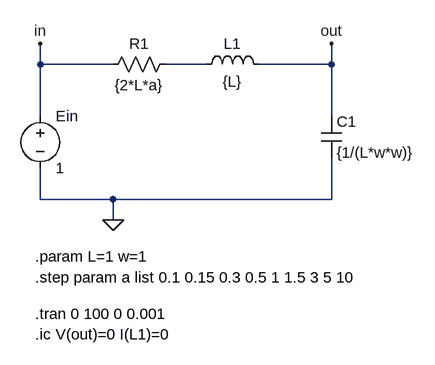
[diagram p0: schematic step-analysis.asc]
step-analysis.asc, the LTspice schematic file:
Version 4
SHEET 1 880 680
WIRE 0 48 0 16
WIRE 112 48 0 48
WIRE 256 48 192 48
WIRE 448 48 448 16
WIRE 448 48 336 48
WIRE 0 128 0 48
WIRE 448 128 448 48
WIRE 0 256 0 208
WIRE 112 256 0 256
WIRE 448 256 448 192
WIRE 448 256 112 256
WIRE 112 288 112 256
FLAG 112 288 0
FLAG 0 16 in
FLAG 448 16 out
SYMBOL voltage 0 112 R0
SYMATTR InstName Ein
SYMATTR Value 1
SYMBOL res 208 32 R90
WINDOW 0 0 56 VBottom 2
WINDOW 3 32 56 VTop 2
SYMATTR InstName R1
SYMATTR Value {2*L*a}
SYMBOL ind 352 64 M270
WINDOW 0 32 56 VTop 2
WINDOW 3 5 56 VBottom 2
SYMATTR InstName L1
SYMATTR Value {L}
SYMBOL cap 432 128 R0
SYMATTR InstName C1
SYMATTR Value {1/(L*w*w)}
TEXT -8 376 Left 2 !.step param a list 0.1 0.15 0.3 0.5 1 1.5 3 5 10
TEXT -8 344 Left 2 !.param L=1 w=1
TEXT -8 432 Left 2 !.tran 0 100 0 0.001
TEXT -8 464 Left 2 !.ic V(out)=0 I(L1)=0

The netlist it stands for:
* step-analysis.asc
V§Ein in 0 1
R1 N001 in {2*L*a}
L1 out N001 {L}
C1 out 0 {1/(L*w*w)}
.step param a list 0.1 0.15 0.3 0.5 1 1.5 3 5 10
.param L=1 w=1
.tran 0 100 0 0.001
.ic V(out)=0 I(L1)=0
.backanno
.end